# Altium schematic sheet PMIC_Power.SchDoc
size 420 x 297 mm; SheetNumber: 12; SheetTotal: 21
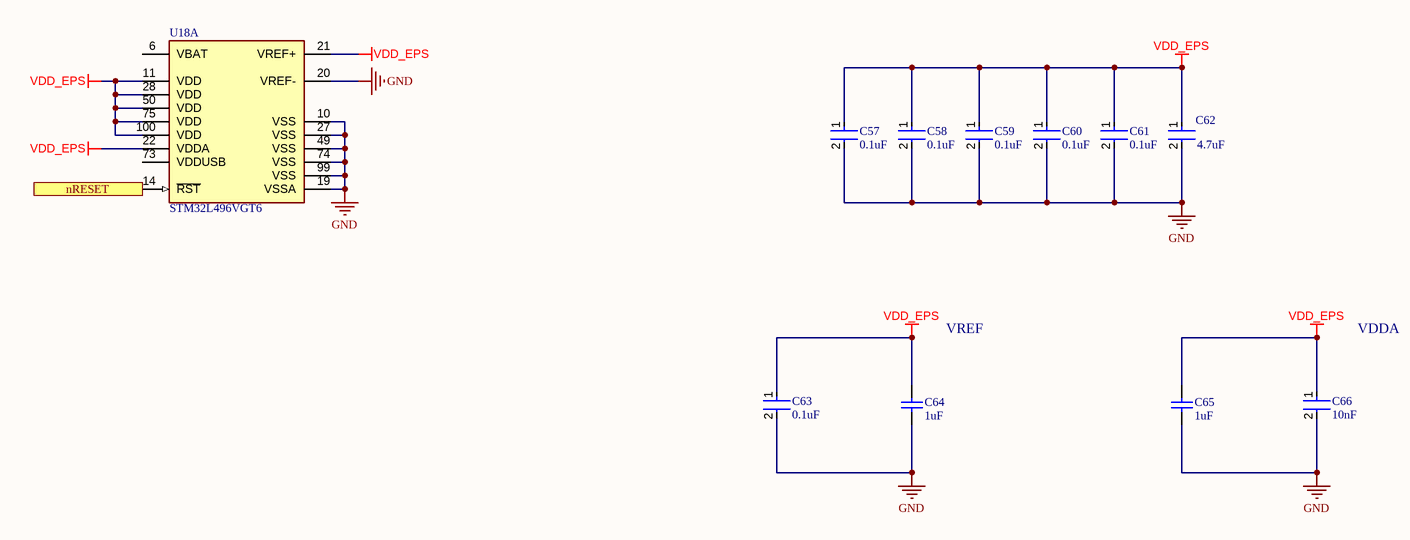
[diagram p0: PMIC_Power.SchDoc]

## Parts
C57  0.1uF  [FP-C0603C-CF-MFG]
C58  0.1uF  [FP-C0603C-CF-MFG]
C59  0.1uF  [FP-C0603C-CF-MFG]
C60  0.1uF  [FP-C0603C-CF-MFG]
C61  0.1uF  [FP-C0603C-CF-MFG]
C62  4.7uF  [FP-GRM188-0_15-IPC_A]
C63  0.1uF  [FP-C0603C-CF-MFG]
C64  1uF  [CAPC1608X90X35LL15T15]
C65  1uF  [CAPC1608X90X35LL15T15]
C66  10nF  [FP-GRM188-0_1-e0_2_0_5-IPC_A]
U18  STM32L496VGT6  [FP-LQFP100-1L-MFG]  (part A of 3)

## Ports
nRESET (in)

## Nets
GND: C57.2 C58.2 C59.2 C60.2 C61.2 C62.2 C63.2 C64.1 C65.1 C66.2 U18.10(VSS) U18.19(VSSA) U18.20(VREF-) U18.27(VSS) U18.49(VSS) U18.74(VSS) U18.99(VSS)
VDD_EPS: C57.1 C58.1 C59.1 C60.1 C61.1 C62.1 C63.1 C64.2 C65.2 C66.1 U18.11(VDD) U18.21(VREF+) U18.22(VDDA) U18.28(VDD) U18.50(VDD) U18.75(VDD) U18.100(VDD)
nRESET: U18.14(~{RST}) ; port nRESET

Not connected (* = marked no-connect by the designer): U18 6(VBAT) 73(VDDUSB)

## Notes on the sheet
- VREF
- VDDA
- THIS DOCUMENT AND THE DATA DISCLOSED HEREIN OR
- HEREWITH IS THE PROPERTY OF ALTIUM LIMITED AND MAY
- DWG NO:
- REVISION
- REV:
- DESCRIPTION
- DATE
- APPROVED
- BE FREELY DISTRIBUTED IN WHOLE. NO RIGHTS ARE
- RESERVED OR EXPRESS OR IMPLIED WARANTEE GIVEN.
- ENG:
- APPROVALS
- PROJECT
- DSN:
- CHK:
- REFERENCE DOCUMENTS
- PROJECT REVISION:
- TITLE
- DOCUMENT REVISION:
- DESIGN ITEM:
- BOM:
- FAB DWG:
- PCB DWG:
- ASSY DWG:
- SCALE:
- A3
- SIZE
- CAGE CODE
- FILE NAME
- DWG NO.
- SHEET
- OF
- REV

## Library data of the parts
C57-C61 C63 = CMP-2006-03061-2: CAP CER 0.1UF 50V X7R 0603; Manufacturer: KEMET; Manufacturer Part Number: C0603C104K5RACTU; Tolerance: 0.1; Temperature Coefficient: 30ppm/°C; Material: Ceramic; Automotive Grade: Grade 1; Value: 0.10 μF; Temperature: -55°C to +125°C; RoHS: TRUE; Temperature Range High: +125°C; Lead Free: Yes; Octopart: https://octopart.com/c0603c104k5ractu-kemet-139244; Digikey Description: CAP CER 0.1UF 50V X7R 0603; Category: Cap; Package: C0603C-CF; ComponentLink2Description: Datasheet; Temperature Range Low: -55°C; Device Class L1: Passive Components; Voltage Rating: 50 V; Automotive: Yes; Device Class L3: Ceramic Capacitors; ComponentLink2URL: https://api.kemet.com/component-edge/download/datasheet/C0603C100J5GACAUTO.pdf; Capacitance: 0.10 μF; Device Class L2: Capacitors; Temperature Characteristic: X7R; Height: 0.87mm
C62 = CMP-06035-000034-2: CAP CER 4.7UF 10V X7S 0603; Material: Ceramic; Tolerance: 10%; Height: 0.8mm; Termination: SMD/SMT; Case Code (Metric): 1608; Voltage Rating: 10V; Width: 0.8mm; Resistor Type: Ceramic; Length: 1.6mm; Voltage Rating (DC): 10V; Weight: 0.000222oz; Dielectric: X7S; Package Quantity: 4000; Mount: Surface Mount; Case Code (Imperial): 0603; Case/Package: 0603; Packaging: Tape and Reel; Thickness: 0.037inch; Min Operating Temperature: -55°C; Capacitance: 4.7uF; Max Operating Temperature: 125°C
C64 C65 = CMP-2006-02298-2: Manufacturer: Kemet; Part Number: C0603C105K4RACTU
C66 = CMP-2006-02943-2: Chip Multilayer Ceramic Capacitors for General Purpose, 0603, 10000pF, X7R, 15%, 10%, 100V; Capacitance: 10nF; Dielectric: X7R; Material: Ceramic; Package Quantity: 4000; Voltage: 100V; Mount: Surface Mount; Min Operating Temperature: -55°C; Thickness: 0.035inch; Height: 0.8mm; Max Operating Temperature: 125°C; Radiation Hardening: No; Lead Free: Lead Free; Case Code (Metric): 1608; REACH SVHC: No SVHC; Termination: SMD/SMT; Tolerance: 10%; Voltage Rating: 100V; Voltage Rating (DC): 100V; Length: 1.6mm; Depth: 0.8mm; Width: 0.031inch; Case Code (Imperial): 0603; Case/Package: 0603; Packaging: Tape and Reel
U18 = CMP-12105-000032-1: IC MCU 32BIT 1MB FLASH 100LQFP; Manufacturer: STMicroelectronics; Ram Size: 320KBytes; Number Of Usb Channels: 1; Interface: I2C,SPI,UART,USART,CAN,USB,LIN,IrDA,Other; Frequency: 80MHz; Min Supply Voltage: 1.05V; Number Of I/Os: 83; Number Of Adc Channels: 16; Number Of Spi Channels: 3; Core Architecture: ARM Cortex-M4; Number Of I2C Channels: 4; Number Of Uart Channels: 6; Max Junction Temp: +105°C; Number Of Pwm Channels: 2; Data Bus Width: 32bits; Standoff Height: 0.05mm; Memory Type: FLASH,SRAM; Max Supply Voltage: 3.6V; Memory Size: 1MBytes; Temperature Range High: +85°C; Device Class L2: Embedded Processors and Controllers; Number Of Cores: 1; Temperature Range Low: -40°C; ComponentLink2URL: https://www.st.com/content/ccc/resource/technical/document/datasheet/group3/3f/73/19/d1/d4/9e/48/34/DM00284211/files/DM00284211.pdf/jcr:content/translations/en.DM00284211.pdf; Temperature: -40°C to +85°C; Device Class L3: Microcontrollers; Device Class L1: Integrated Circuits (ICs); Height: 1.6mm; Manufacturer Part Number: STM32L496VGT6; Ambient Temperature Range Low: -40°C; RoHS: TRUE; Automotive: No; Number Of A/D Converters: 3; Ambient Temperature Range High: +85°C; Digikey Description: IC MCU 32BIT 1MB FLASH 100LQFP; ComponentLink2Description: Datasheet; Package: LQFP100-1L; Lead Free: Yes; Octopart: https://octopart.com/stm32l496vgt6-stmicroelectronics-80826723; Category: IC; Number Of Timers/Counters: 16